# Altium project PPM_USB.PrjPcb
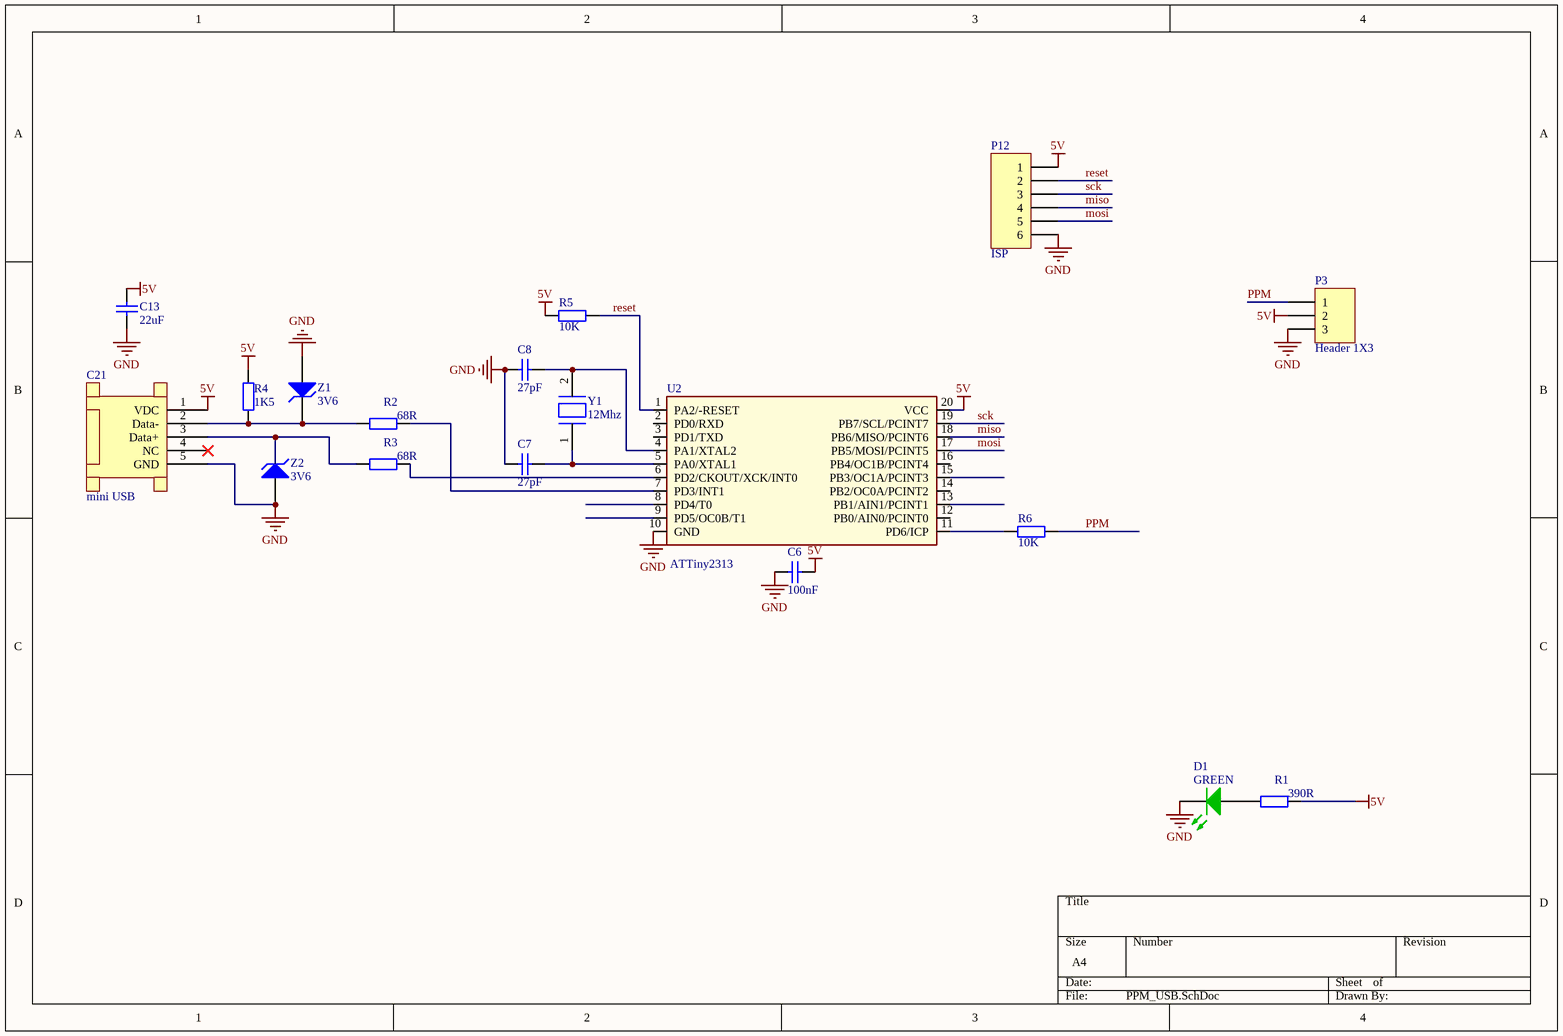
[diagram p0: PPM_USB.SchDoc]
1 sheet, 18 parts. Net scope: global (net labels, ports and power ports of the same name join across sheets).
Board files: PPM_USB.PcbDoc, PPM_USB_panelized.PcbDoc

## Sheet PPM_USB.SchDoc
size A4

### Parts
C6  100nF  [FP_0603_CAP_080]
C7  27pF  [FP_0603_CAP_080]
C8  27pF  [FP_0603_CAP_080]
C13  22uF  [FP_0805_CAP_085]
C21  mini USB  [USB/SM0.8-6H5]
D1  GREEN  [FP_0603_LED_G]
P3  Header 1X3  [HEADER_2.54MM_M_1x3]  (no BOM)
P12  ISP  [HEADER_2.00MM_M_1x6]  (no BOM)
R1  390R  [FP_0603_RES]
R2  68R  [FP_0603_RES]
R3  68R  [FP_0603_RES]
R4  1K5  [FP_0603_RES]
R5  10K  [FP_0603_RES]
R6  10K  [FP_0603_RES]
U2  ATTiny2313  [DIGITAL_SOIC20W]
Y1  12Mhz  [FP_CRYSTAL_HC49_TH]
Z1  3V6  [FP_SOD-123]
Z2  3V6  [FP_SOD-123]

### Nets
5V: C6.2 C13.2 C21.1(VDC) P3.2 P12.1 R1.1 R4.1 R5.1 U2.20(VCC)
GND: C6.1 C7.1 C8.1 C13.1 C21.5(GND) D1.K P3.3 P12.6 U2.10(GND) Z1.A Z2.A
miso: P12.4 U2.18(PB6/MISO/PCINT6)
mosi: P12.5 U2.17(PB5/MOSI/PCINT5)
PPM: P3.1 R6.2
reset: P12.2 R5.2 U2.1(PA2/-RESET)
sck: P12.3 U2.19(PB7/SCL/PCINT7)
NetC7_2: C7.2 U2.5(PA0/XTAL1) Y1.1
NetC8_2: C8.2 U2.4(PA1/XTAL2) Y1.2
NetC21_2: C21.2(Data-) R2.2 R4.2 Z1.K
NetC21_3: C21.3(Data+) R3.2 Z2.K
NetD1_A: D1.A R1.2
NetR2_1: R2.1 U2.7(PD3/INT1)
NetR3_1: R3.1 U2.6(PD2/CKOUT/XCK/INT0)
NetR6_1: R6.1 U2.11(PD6/ICP)

Not connected (* = marked no-connect by the designer): C21 4(NC)*; U2 2(PD0/RXD) 3(PD1/TXD) 8(PD4/T0) 9(PD5/OC0B/T1) 12(PB0/AIN0/PCINT0) 13(PB1/AIN1/PCINT1) 14(PB2/OC0A/PCINT2) 15(PB3/OC1A/PCINT3) 16(PB4/OC1B/PCINT4)

### Library data of the parts
C6 = CAP: Capacitor; Order info: [82-01-25]; Value: 100nF
C7 C8 = CAP: Capacitor; Order info: TODO; Value: 27pF
C13 = CAP: Capacitor; Order info: [82-08-19]; Value: 22uF
D1 = LED_G: Typical LED; Order info: 95-03-09
P3 = Header 1X3: Header, 3-Pin; Order info: TODO
P12 = Header 6: Header, 6-Pin; Order info: ---; LatestRevisionDate: 17-Jul-2002; LatestRevisionNote: Re-released for DXP Platform.; Publisher: Altium Limited
R1 = RES: Resistor; Value: 390R; Order info: 81-10-21
R2-R6 = RES: Resistor; Order info: TODO
  R2 R3: Value: 68R
  R4: Value: 1K5
  R5 R6: Value: 10K
U2 = ATTiny2313: Order info: [89-21-91]
Y1 = XTAL: Quartz; Value: 12Mhz
Z1 Z2 = ZENER: Zener Diode; Supplier: TODO; U_Z: 3V6
C21 = mini USB: Order info: 43-16-44